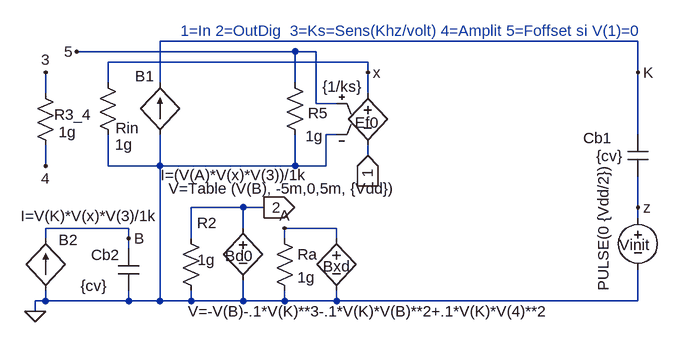
[diagram p0: schematic Vco46a.asc]
Vco46a.asc, the LTspice schematic file:
Version 4
SHEET 1 1252 680
WIRE -352 512 -352 496
WIRE -336 176 -336 144
WIRE -336 288 -336 256
WIRE -336 400 -336 384
WIRE -336 496 -352 496
WIRE -336 496 -336 480
WIRE -240 160 -240 128
WIRE -240 288 -240 240
WIRE -208 384 -336 384
WIRE -208 400 -208 384
WIRE -208 416 -208 400
WIRE -208 496 -336 496
WIRE -208 496 -208 480
WIRE -160 160 -160 96
WIRE -160 288 -240 288
WIRE -160 288 -160 240
WIRE -160 496 -208 496
WIRE -160 496 -160 288
WIRE -112 400 -112 352
WIRE -112 496 -160 496
WIRE -112 496 -112 480
WIRE -32 352 -112 352
WIRE -32 384 -32 352
WIRE -32 496 -112 496
WIRE -32 496 -32 464
WIRE 0 352 -32 352
WIRE 32 400 32 384
WIRE 32 496 -32 496
WIRE 32 496 32 480
WIRE 48 112 -288 112
WIRE 48 160 48 112
WIRE 48 288 -160 288
WIRE 48 288 48 240
WIRE 80 112 48 112
WIRE 80 192 80 112
WIRE 96 288 48 288
WIRE 96 288 96 240
WIRE 112 192 80 192
WIRE 112 240 96 240
WIRE 112 384 32 384
WIRE 112 400 112 384
WIRE 112 496 32 496
WIRE 112 496 112 480
WIRE 160 128 -240 128
WIRE 160 144 160 128
WIRE 160 176 160 144
WIRE 160 272 160 256
WIRE 576 96 -160 96
WIRE 576 144 576 96
WIRE 576 240 576 144
WIRE 576 352 576 304
WIRE 576 368 576 352
WIRE 576 496 112 496
WIRE 576 496 576 448
FLAG 160 272 1
IOPIN 160 272 In
FLAG 576 144 K
FLAG -208 400 B
FLAG 32 384 A
FLAG 576 352 z
FLAG -336 144 3
FLAG -336 288 4
FLAG -288 112 5
FLAG 160 144 x
FLAG 0 352 2
IOPIN 0 352 Out
FLAG -352 512 0
SYMBOL res -256 144 R0
WINDOW 0 28 86 Left 0
WINDOW 3 27 111 Left 0
SYMATTR InstName Rin
SYMATTR Value 1g
SYMBOL bi -160 240 R180
WINDOW 0 9 90 Left 0
WINDOW 3 -227 -62 Left 0
SYMATTR InstName B1
SYMATTR Value I=(V(A)*V(x)*V(3))/1k
SYMBOL bi -336 480 R180
WINDOW 0 -49 78 Left 0
WINDOW 3 -171 115 Left 0
SYMATTR InstName B2
SYMATTR Value I=V(K)*V(x)*V(3)/1k
SYMBOL cap -224 416 R0
WINDOW 3 -58 57 Left 0
WINDOW 0 -42 9 Left 0
SYMATTR Value {cv}
SYMATTR InstName Cb2
SYMATTR SpiceLine Rpar=1g
SYMBOL bv 112 384 R0
WINDOW 0 -21 59 Left 0
WINDOW 3 -229 128 Left 0
SYMATTR InstName Bxd
SYMATTR Value V=-V(B)-.1*V(K)**3-.1*V(K)*V(B)**2+.1*V(K)*V(4)**2
SYMBOL res 16 384 R0
SYMATTR InstName Ra
SYMATTR Value 1g
SYMBOL voltage 576 352 R0
WINDOW 0 -29 58 Left 0
WINDOW 3 -53 -65 VRight 0
WINDOW 123 0 0 Left 0
WINDOW 39 0 0 Left 0
SYMATTR InstName Vinit
SYMATTR Value PULSE(0 {Vdd/2})
SYMBOL cap 560 240 R0
WINDOW 0 -68 5 Left 0
WINDOW 3 -8 33 Right 0
SYMATTR InstName Cb1
SYMATTR Value {cv}
SYMATTR SpiceLine Rpar=1g
SYMBOL res -352 160 R0
WINDOW 0 29 49 Left 0
SYMATTR InstName R3_4
SYMATTR Value 1g
SYMBOL e 160 160 R0
WINDOW 0 -20 61 Left 0
WINDOW 3 -70 6 Left 0
SYMATTR InstName Ef0
SYMATTR Value {1/ks}
SYMBOL bv -32 368 R0
WINDOW 0 -28 59 Left 0
WINDOW 3 -115 -45 Left 0
SYMATTR InstName Bd0
SYMATTR Value V=Table (V(B), -5m,0,5m, {Vdd})
SYMBOL res -128 384 R0
WINDOW 0 25 -8 Left 0
WINDOW 3 26 49 Left 0
SYMATTR InstName R2
SYMATTR Value 1g
SYMBOL res 32 144 R0
WINDOW 0 36 63 Left 0
WINDOW 3 32 98 Left 0
SYMATTR InstName R5
SYMATTR Value 1g
TEXT -128 80 Left 0 ;1=In 2=OutDig  3=Ks=Sens(Khz/volt) 4=Amplit 5=Foffset si V(1)=0

The netlist it stands for:
* Vco46a.asc
Rin x 0 1g
B1 0 K I=(V(A)*V(x)*V(3))/1k
B2 0 B I=V(K)*V(x)*V(3)/1k
Cb2 B 0 {cv} Rpar=1g
Bxd A 0 V=-V(B)-.1*V(K)**3-.1*V(K)*V(B)**2+.1*V(K)*V(4)**2
Ra A 0 1g
Vinit z 0 PULSE(0 {Vdd/2})
Cb1 K z {cv} Rpar=1g
R3_4 3 4 1g
Ef0 x 1 5 0 {1/ks}
Bd0 2 0 V=Table (V(B), -5m,0,5m, {Vdd})
R2 2 0 1g
R5 5 0 1g
* 1=In 2=OutDig  3=Ks=Sens(Khz/volt) 4=Amplit 5=Foffset si V(1)=0
.backanno
.end